# Altium schematic sheet JL7016M8.SchDoc
size 266 x 203 mm; SheetNumber: 3; SheetTotal: 4
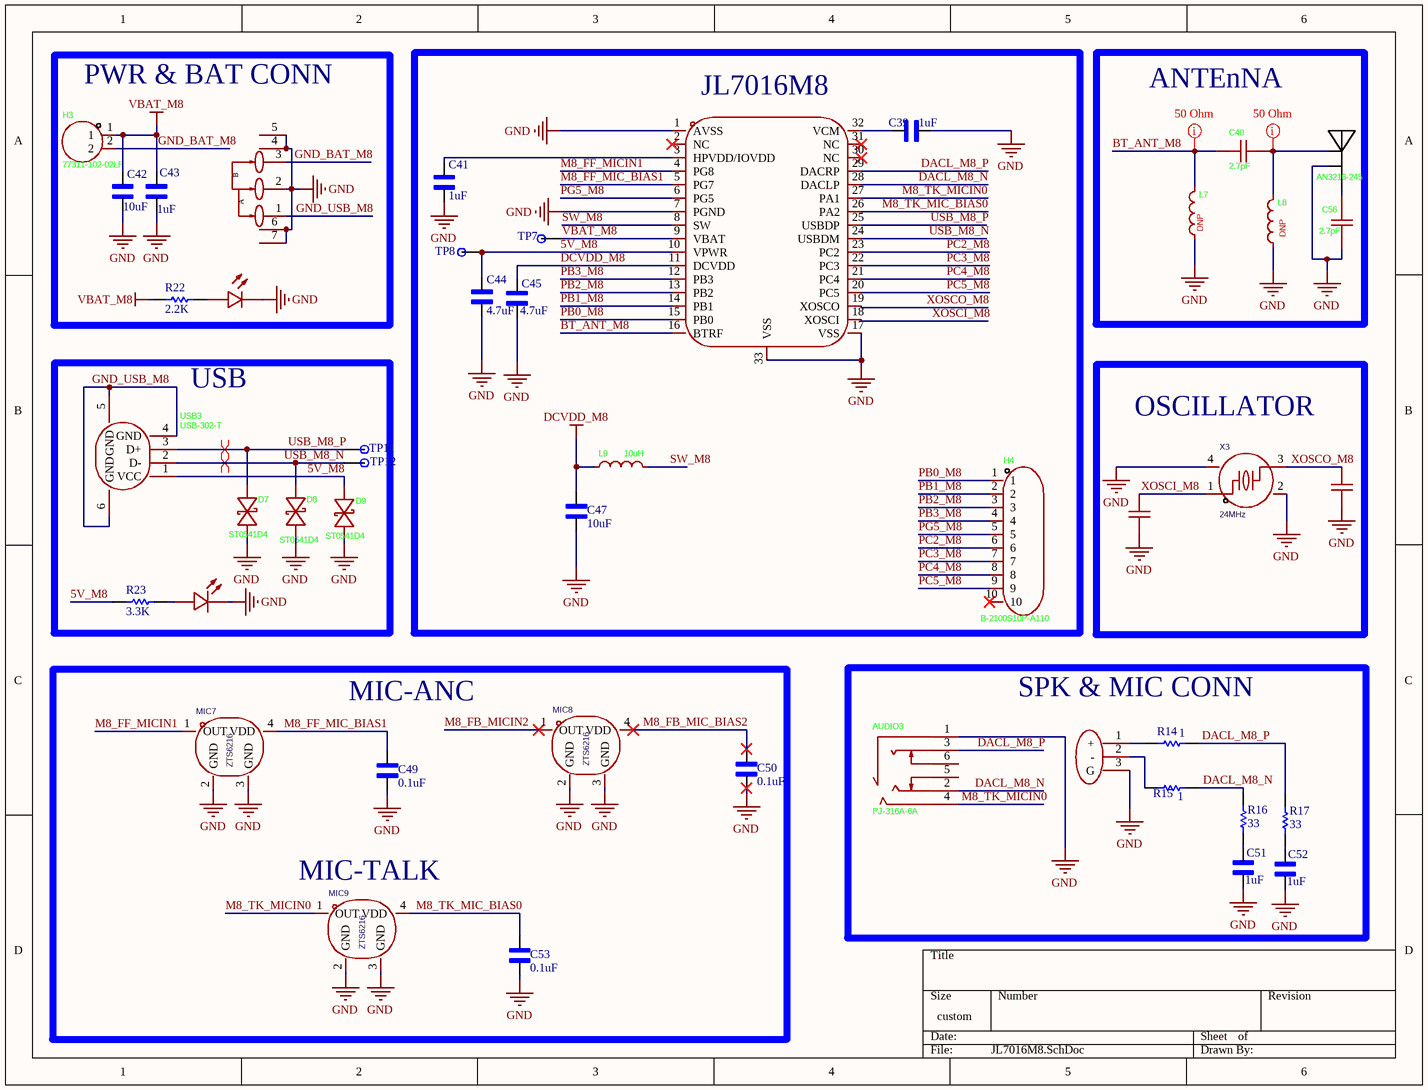
[diagram p0: JL7016M8.SchDoc]

## Parts
ANT3  AN3216-245  [CUSTOME ANTEENA]
AUDIO3  PJ-316A-6A  [AUDIO-SMD_PJ-316A-6A]
C39  1uF  [CAPC3216X170N]
C40  2.7pF  [C0603]
C41  1uF  [CAPC3216X170N]
C42  10uF  [CAPC3216X170N]
C43  1uF  [CAPC3216X170N]
C44  value 4.7uF  [CAPC3216X170N]  (hidden comment: 1uF)
C45  value 4.7uF  [CAPC3216X170N]  (hidden comment: 1uF)
C46  12pF  [CAPC3216X170N]  (value not drawn)
C47  10uF  [CAPC3216X170N]
C48  12pF  [CAPC3216X170N]  (value not drawn)
C49  0.1uF  [CAPC3216X170N]
C50  0.1uF  [CAPC3216X170N]
C51  1uF  [CAPC3216X170N]
C52  1uF  [CAPC3216X170N]
C53  0.1uF  [CAPC3216X170N]
C56  2.7pF  [C0402]
D7  ST0541D4  [DFN1006-BI]
D8  ST0541D4  [DFN1006-BI]
D9  ST0541D4  [DFN1006-BI]
H3  77311-102-02LF  [HDR-TH_2P-P2.54-V-M-1]
H4  B-2100S10P-A110  [HDR-TH_10P-P2.54-V-M-1]
L7  DNP  [L0603]
L8  DNP  [L0603]
L9  10uH  [L0603]
LED5  LTST-C191GKT  [LED0603-R-RD_GREEN]  (value not drawn)
LED6  KT-0603R  [LED0603-RD]  (value not drawn)
MIC7  ZTS6216  [MIC-SMD_4P-L2.8-W1.9-P1.84-TL]
MIC8  ZTS6216  [MIC-SMD_4P-L2.8-W1.9-P1.84-TL]
MIC9  ZTS6216  [MIC-SMD_4P-L2.8-W1.9-P1.84-TL]
P4  1.27-1*3P针  [HDR-TH_3P-P1.27-V-M-1]  (value not drawn)
R14  value 1  [R0603]  (hidden comment: O OHM)
R15  value 1  [R0603]  (hidden comment: O OHM)
R16  value 33  [R0603]  (hidden comment: 33 Ohm)
R17  value 33  [R0603]  (hidden comment: 33 Ohm)
R22  value 2.2K  [R1206]
R23  3.3K  [R1206]
SW3  MK-12C02-G015  [SW-SMD_G-SWITCH_MK-12C02-G015]  (value not drawn)
TP7  *  [TP]  (value not drawn)
TP8  *  [TP]  (value not drawn)
TP11  TP  [TP]  (value not drawn)
TP12  TP  [TP]  (value not drawn)
U3  JL7016M8  [QFN-32_L4.0-W4.0-P0.40-TL-EP2.7_1]  (value not drawn)
USB3  USB-302-T  [USB-A-TH_USB-302-T]
X3  24MHz  [CRYSTAL-SMD_4P-L2.0-W1.6-BL-A]

## Blocks framed on the sheet
PWR & BAT CONN: C42 C43 H3 LED5 R22 SW3
JL7016M8: C39 C41 C44 C45 C47 H4 L9 TP7 TP8 U3
ANTEnNA: ANT3 C40 C56 L7 L8
USB: D7-D9 LED6 R23 TP11 TP12 USB3
OSCILLATOR: C46 C48 X3
SPK & MIC CONN: AUDIO3 C51 C52 P4 R14-R17

## Nets
DCVDD_M8: C45.1 C47.2 L9.1 U3.11(DCVDD)
GND: ANT3.2 AUDIO3.1 C39.2 C41.2 C42.1 C43.2 C44.2 C45.2 C46.1 C47.1 C48.1 C49.1 C50.1 C51.1 C52.1 C53.1 C56.1 D7.1 D8.1 D9.1 L7.1 L8.1 LED5.2(C) LED6.1(K) MIC7.2(GND) MIC7.3(GND) MIC8.2(GND) MIC8.3(GND) MIC9.2(GND) MIC9.3(GND) P4.3(G) SW3.2 SW3.4 SW3.5 SW3.6 SW3.7 U3.1(AVSS) U3.7(PGND) U3.17(VSS) U3.33(VSS) X3.2(GND) X3.4(GND)
VBAT_M8: C42.2 C43.1 H3.1 R22.2 TP7.1 U3.9(VBAT)
5V_M8: C44.1 D9.2 R23.2 TP8.1 U3.10(VPWR) USB3.1(VCC)
BT_ANT_M8: C40.1 L7.2 U3.16(BTRF)
DACL_M8_N: AUDIO3.2 R15.1 R16.1 U3.28(DACLP)
DACL_M8_P: AUDIO3.3 R14.1 R17.1 U3.29(DACRP)
GND_BAT_M8: H3.2 SW3.3
GND_USB_M8: SW3.1 USB3.4(GND) USB3.5(GND) USB3.6(GND)
M8_FB_MIC_BIAS2: C50.2 MIC8.4(VDD)
M8_FB_MICIN2: MIC8.1(OUT)
M8_FF_MIC_BIAS1: C49.2 MIC7.4(VDD) U3.5(PG7)
M8_FF_MICIN1: MIC7.1(OUT) U3.4(PG8)
M8_TK_MIC_BIAS0: C53.2 MIC9.4(VDD) U3.26(PA2)
M8_TK_MICIN0: AUDIO3.4 MIC9.1(OUT) U3.27(PA1)
PB0_M8: H4.1 U3.15(PB0)
PB1_M8: H4.2 U3.14(PB1)
PB2_M8: H4.3 U3.13(PB2)
PB3_M8: H4.4 U3.12(PB3)
PC2_M8: H4.6 U3.23(PC2)
PC3_M8: H4.7 U3.22(PC3)
PC4_M8: H4.8 U3.21(PC4)
PC5_M8: H4.9 U3.20(PC5)
PG5_M8: H4.5 U3.6(PG5)
SW_M8: L9.2 U3.8(SW)
USB_M8_N: D8.2 TP12.1 U3.24(USBDM) USB3.2(D-)
USB_M8_P: D7.2 TP11.1 U3.25(USBDP) USB3.3(D+)
XOSCI_M8: C48.2 U3.18(XOSCI) X3.1
XOSCO_M8: C46.2 U3.19(XOSCO) X3.3
NetANT3_1: ANT3.1 C40.2 L8.2
NetANT3_3: ANT3.3 C56.2
NetC39_1: C39.1 U3.32(VCM)
NetC41_1: C41.1 U3.3(HPVDD/IOVDD)
NetC51_2: C51.2 R16.2
NetC52_2: C52.2 R17.2
NetLED5_1: LED5.1(A) R22.1
NetLED6_2: LED6.2(A) R23.1
NetP4_1: P4.1(+) R14.2
NetP4_2: P4.2(-) R15.2

Not connected (* = marked no-connect by the designer): AUDIO3 5 6; H4 10*; U3 2(NC)* 30(NC)* 31(NC)*

## Layout directives
rule Width Constraint [Pref Impedance = 50.00ohms    Min Impedance = 50.00ohms    Max Impedance = 50.00ohms]: BT_ANT_M8, NetANT3_1
differential pair: USB_M8_N, USB_M8_P

## Notes on the sheet
- MIC-ANC
- (near MIC9) MIC-TALK
- (in symbol MK-12C02-G015_C2911519) B; A

## Library data of the parts
ANT3 = AN3216-245: Manufacturer: Rainsun(霖昱微); Add into BOM: yes; Frequency(Center/Band): 2.45GHz; Bandwidth: 100MHz; Peak Gain: 0.5dBi; Impedance: 50Ω; Power: 1W; VSWR: 2.5; Symbol: AN3216-245; Device: AN3216-245; LCSC Part Name: AN3216-245; Supplier Part: C2916136; Manufacturer Part: AN3216-245; Supplier Footprint: 1206; JLCPCB Part Class: Extended Part; Datasheet: https://item.szlcsc.com/datasheet/AN3216-245/3211390.html; Supplier: LCSC; Convert to PCB: yes; Operating Temperature: -40℃~+85℃; Length: 3.2mm; Width: 1.6mm; Height: 1.3mm
AUDIO3 = PJ-316A-6A: Manufacturer: 韩国韩荣; Add into BOM: yes; Connector Type: 3.5mm Headphone Jack; Current Rating: 500mA; Voltage Rating (Max): 30V; Symbol: PJ-316A-6A; Device: PJ-316A-6A; LCSC Part Name: 3.5mm耳机座; Supplier Part: C128987; Manufacturer Part: PJ-316A-6A; Supplier Footprint: SMD; JLCPCB Part Class: Extended Part; Datasheet: https://item.szlcsc.com/datasheet/PJ-316A-6A/140273.html; Supplier: LCSC; Convert to PCB: yes; Contact Material: Phosphor Bronze; Contact Plating: Gold
C39 C41 C43-C45 C51 C52 = CAP_1uF
  C39 C41 C43 C51 C52: Value: 1uF
C40 C56 = 0603CG2R7C500NT: Manufacturer: FH(风华); Add into BOM: yes; Voltage Rating: 50V; Temperature Coefficient: C0G; Symbol: 0603CG2R7C500NT; Device: 0603CG2R7C500NT; LCSC Part Name: ±0.25pF 2.7pF 50V; Supplier Part: C95180; Manufacturer Part: 0603CG2R7C500NT; Supplier Footprint: 0603; JLCPCB Part Class: Extended Part; Datasheet: https://item.szlcsc.com/datasheet/0603CG2R7C500NT/96381.html; Supplier: LCSC; Convert to PCB: yes; Value: 2.7pF
C42 C47 = CAP_10F: Value: 10uF
C46 C48 = 0402CG120J500NT: Manufacturer: FH(风华); Add into BOM: yes; Tolerance: ±5%; Voltage Rating: 50V; Temperature Coefficient: C0G; Symbol: 0402CG120J500NT; Device: 0402CG120J500NT; LCSC Part Name: 12pF ±5% 50V; Supplier Part: C1547; Manufacturer Part: 0402CG120J500NT; Supplier Footprint: 0402; JLCPCB Part Class: Basic Part; Datasheet: https://item.szlcsc.com/datasheet/0402CG120J500NT/1899.html; Supplier: LCSC; Convert to PCB: yes; Value: 12pF
C49 C50 C53 = CAP_0.1uF: 100nF 10V X7R ±5% 0402 Multilayer Ceramic Capacitors MLCC - SMD/SMT ROHS; Manufacturer: Walsin Tech Corp; MFR.Part #: 0402B104J100CT; JLCPCB Part #: C237170; Package: 0402; Value: 0.1uF
D7-D9 = ST0541D4: Manufacturer: Leiditech(雷卯电子); Add into BOM: yes; Reverse Stand-Off Voltage (Vrwm): 5V; Clamping Voltage: 23V; Peak Pulse Power Dissipation (Ppp): 110W@8/20us; Voltage - Breakdown: 6V; Reverse Leakage Current (Ir): 500nA; level of protection: IEC 61000-4-4；IEC 61000-4-5；IEC 61000-4-2; Type: ESD; Junction Capacitance: 0.22pF; Symbol: ST0541D4; Device: ST0541D4; LCSC Part Name: ESD 5V截止; Supplier Part: C5139355; Manufacturer Part: ST0541D4; Supplier Footprint: DFN1006-2; JLCPCB Part Class: Extended Part; Datasheet: https://item.szlcsc.com/datasheet/ST0541D4/5751044.html; Supplier: LCSC; Convert to PCB: yes
H3 = 77311-102-02LF: Manufacturer: Amphenol; Add into BOM: yes; Pitch: 2.54mm; Circluar Pins/Square Pins: Pin Header; Current Rating: 3A; Symbol: 77311-102-02LF; Device: 77311-102-02LF; LCSC Part Name: 间距:2.54mm 方针 直插; Supplier Part: C180247; Manufacturer Part: 77311-102-02LF; Supplier Footprint: 插件,P=2.54mm; JLCPCB Part Class: Extended Part; Datasheet: https://item.szlcsc.com/datasheet/77311-102-02LF/191642.html; Supplier: LCSC; Convert to PCB: yes; Pin Structure: -; Row Spacing: -; Mounting Type: Through Hole; Number of Rows: 1; Number of Pins: 2P; Voltage Rating (Max): -; Length of Mating Pin: -; Insulation Height: 2.54mm; Contact Material: Phosphor Bronze; Contact Plating: Tin; Operating Temperature: -65℃~+125℃; Color: Black
H4 = B-2100S10P-A110: Manufacturer: Ckmtw(灿科盟); Symbol: 210S-1*10P L=11.6MMGold-plated black; Add into BOM: yes; Pin Structure: 1x10P; Pitch: 2.54mm; Device: B-2100S10P-A110; LCSC Part Name: 2.54直排针; Supplier Part: C124372; Manufacturer Part: B-2100S10P-A110; Supplier Footprint: 插件,P=2.54mm; JLCPCB Part Class: Extended Part; Datasheet: https://item.szlcsc.com/datasheet/B-2100S10P-A110/125647.html; Supplier: LCSC; Convert to PCB: yes; Row Spacing: -; Circluar Pins/Square Pins: -; Mounting Type: Through Hole; Number of Rows: 1; Number of Pins: 10P; Current Rating: -; Voltage Rating (Max): -; Length of Mating Pin: 6mm; Insulation Height: 2.54mm; Length of End Connection Pin: 3mm; Contact Material: Brass; Contact Plating: -; Operating Temperature: -40℃~+105℃; Color: Black
L7 L8 = 33nH: Manufacturer: muRata(村田); Symbol: DFE18SAN1R0ME0L; Add into BOM: yes; Value: 1uH; Tolerance: ±20%; Current Rating: 1.6A; DC Resistance(DCR): 144mΩ; Device: DFE18SAN1R0ME0L; LCSC Part Name: 1uH ±20%; Supplier Part: C2044564; Manufacturer Part: DFE18SAN1R0ME0L; Supplier Footprint: 0603; JLCPCB Part Class: Extended Part; Datasheet: https://atta.szlcsc.com/upload/public/pdf/source/20210601/1EEB72040C737E24AB5C3900F417DA4B.pdf; Supplier: LCSC; Convert to PCB: yes; Current - Saturation (Isat): -; Q @ Frequency: -; Frequency - Self Resonant: -; Ratings: -
L9 = 10uH: Value: 1uH; LCSC Part Name: 1uH ±20%; Q @ Frequency: -; Frequency - Self Resonant: -; Ratings: -
LED5 = LTST-C191GKT: -55℃~+85℃ 100mW 12mcd 130° 2.1V 20mA 565nm 569nm Discrete Diode Green Water Clear 0603 LED Indication - Discrete ROHS; Manufacturer: LITEON(光宝); Add into BOM: yes; Symbol: LTST-C191GKT; Device: LTST-C191GKT; LCSC Part Name: LTST-C191GKT; Supplier Part: C99289; Manufacturer Part: LTST-C191GKT; Supplier Footprint: 0603; JLCPCB Part Class: Extended Part; Datasheet: https://item.szlcsc.com/datasheet/LTST-C191GKT/100502.html; Supplier: LCSC; Convert to PCB: yes; Illumination Color: -; Voltage - Forward(Vf): 2.1V; Power(Watts): 100mW; Forward Current: 20mA; Wavelength - Dominant: 569nm; Peak Wavelength: 565nm; Diode Configuration: -; Lens Color: Water Clear; Color Temperature: -; Luminous Intensity: 12mcd; Viewing Angle: 130°; Mounting Style: -; Operating Temperature: -55℃~+85℃
LED6 = KT-0603R: Manufacturer: KENTO; Add into BOM: yes; Emitted Color: Red; Symbol: KT-0603R; Device: KT-0603R; LCSC Part Name: 0603 红灯 高亮; Supplier Part: C2286; Manufacturer Part: KT-0603R; Supplier Footprint: 0603; JLCPCB Part Class: Basic Part; Datasheet: https://atta.szlcsc.com/upload/public/pdf/source/20160616/1466072038404.pdf; Supplier: LCSC; Convert to PCB: yes; Power Dissipation: -; Forward Current: -; Dominant Wavelength: -; Peak Wavelength: -; Diode Configuration: -; Lens Color: -; Color Temperature: -; Viewing Angle: -; Mounting Sytle: -; Operating Temperature: -40℃~+85℃
MIC7-MIC9 = ZTS6216: Manufacturer: ZILLTEK(钰太); Add into BOM: yes; Direction: Omnidirectional; Voltage - Supply: 1.5V~3.6V; Current Consumption: 120uA; S/N Ratio: 65dB; Sensitivity: -38dB; Impedance: 100Ω; Output Type: 模拟输出; Symbol: ZTS6216; Device: ZTS6216; LCSC Part Name: 1.5V~3.6V38dB; Supplier Part: C481302; Manufacturer Part: ZTS6216; Supplier Footprint: SMD-4P,2.8x1.9mm; JLCPCB Part Class: Extended Part; Datasheet: https://item.szlcsc.com/datasheet/ZTS6216/488750.html; Supplier: LCSC; Convert to PCB: yes; Length: 2.75mm; Width: 1.85mm; Height: 1mm
P4 = 1.27-1*3P针: Manufacturer: BOOMELE(博穆精密); Symbol: 1.27mm/1*3p; Add into BOM: yes; Pin Structure: 1x3P; Pitch: 1.27mm; Circluar Pins/Square Pins: Pin Header; Current Rating: 3A; Device: 1.27-1*3P针; LCSC Part Name: 1x3P 间距:1.27mm 方针 直插; Supplier Part: C24980; Manufacturer Part: 1.27-1*3P针; Supplier Footprint: 插件,P=1.27mm; JLCPCB Part Class: Extended Part; Datasheet: https://item.szlcsc.com/datasheet/1.27-1*3P%25E9%2592%2588/25717.html; Supplier: LCSC; Convert to PCB: yes; Row Spacing: -; Mounting Type: Through Hole; Number of Rows: 1; Number of Pins: 3P; Voltage Rating (Max): -; Length of Mating Pin: 3mm; Insulation Height: 1.7mm; Length of End Connection Pin: 2.5mm; Contact Material: Brass; Contact Plating: -; Operating Temperature: -55℃~+105℃; Color: Black; Supplementary Features: -
R14 R15 = RES_1: -55℃~+155℃ 33Ω 50V 62.5mW Thick Film Resistor ±100ppm/℃ ±5% 0402 Chip Resistor - Surface Mount ROHS; Manufacturer: YAGEO; MFR.Part #: RC0402JR-0733RL; JLCPCB Part #: C137880; Package: 0402
R16 R17 = RES_33: -55℃~+155℃ 33Ω 50V 62.5mW Thick Film Resistor ±100ppm/℃ ±5% 0402 Chip Resistor - Surface Mount ROHS; Manufacturer: YAGEO; MFR.Part #: RC0402JR-0733RL; JLCPCB Part #: C137880; Package: 0402
R22 = RES_2.2K: -55℃~+155℃ 33Ω 50V 62.5mW Thick Film Resistor ±100ppm/℃ ±5% 0402 Chip Resistor - Surface Mount ROHS; Manufacturer: YAGEO; MFR.Part #: RC0402JR-0733RL; JLCPCB Part #: C137880; Package: 0402
R23 = RES_3.3K: -55℃~+155℃ 33Ω 50V 62.5mW Thick Film Resistor ±100ppm/℃ ±5% 0402 Chip Resistor - Surface Mount ROHS; Manufacturer: YAGEO; MFR.Part #: RC0402JR-0733RL; JLCPCB Part #: C137880; Package: 0402; Value: 3.3K
SW3 = MK-12C02-G015_C2911519: Manufacturer: G-Switch(品赞); Add into BOM: yes; Circuit: SPDT; Actuator Style: Rectangular Columnar; Switch Height: 4.2mm; Actuator Color: Black; Current Rating: 1A; Voltage Rating: 6V; Life: 10,000 Cycles; Symbol: MK-12C02-G015; Device: MK-12C02-G015_C2911519; LCSC Part Name: 七脚贴片微型拨动开关 G1.5; Supplier Part: C2911519; Manufacturer Part: MK-12C02-G015; Supplier Footprint: SMD,6.6x1.4mm; JLCPCB Part Class: Extended Part; Datasheet: https://item.szlcsc.com/datasheet/MK-12C02-G015/3191561.html; Supplier: LCSC; Convert to PCB: yes; Termination Style: -; Length: 6.6mm; Width: 1.4mm; Mounting Type: Surface Mount, Right Angle; Operating Temperature: -20℃~+70℃
TP7 TP8 TP11 TP12 = TP: test point
U3 = JL7016M8: Manufacturer: JL(杰理); Add into BOM: yes; Symbol: JL7016M8; Device: JL7016M8; LCSC Part Name: JL7016M8; Supplier Part: C22440800; Manufacturer Part: JL7016M8; Supplier Footprint: QFN-32(4x4); JLCPCB Part Class: Extended Part; Datasheet: https://item.szlcsc.com/datasheet/JL7016M8/24089791.html; Supplier: LCSC; Convert to PCB: yes
USB3 = USB-302-T: Manufacturer: SOFNG(硕方); Add into BOM: yes; Connector Type: Type-A; Protocol Standard: USB 2.0; Gender: Female; Number of Contacts: 4P; Number of Ports: 1; Current Rating-Power: 50mA; Voltage Rating: 24V; Detection color: White; Symbol: USB-302; Device: USB-302-T; LCSC Part Name: Type-A 母 弯插; Supplier Part: C112456; Manufacturer Part: USB-302-T; Supplier Footprint: 弯插; JLCPCB Part Class: Extended Part; Datasheet: https://item.szlcsc.com/datasheet/USB-302-T/113689.html; Supplier: LCSC; Convert to PCB: yes; Mounting Type: Right Angle; Operating Temperature: -25℃~+75℃
X3 = XL7EL89CKI-111YLC-24M: Manufacturer: YXC(扬兴晶振); Add into BOM: yes; Normal temperature Frequency Tolerance: ±10ppm; Load Capacitance: 8pF; Frequency Stability: ±20ppm; Symbol: XL7EL89CKI-111YLC-24M; Device: XL7EL89CKI-111YLC-24M; LCSC Part Name: YSX211SL 24MHZ 4P 2016 8PF ±10PPM -40~85℃ (±20PPM); Supplier Part: C2965580; Manufacturer Part: XL7EL89CKI-111YLC-24M; Supplier Footprint: SMD2016-4P; JLCPCB Part Class: Extended Part; Datasheet: https://item.szlcsc.com/datasheet/XL7EL89CKI-111YLC-24M/3357716.html; Supplier: LCSC; Convert to PCB: yes; Type: Surface Mount Crystal; Value: 24MHz; Equivalent Series Resistance(ESR): -; Operating Temperature: -40℃~+85℃